# EAGLE design M8-Relay-Dual-Latching (EAGLE 9.6.2)
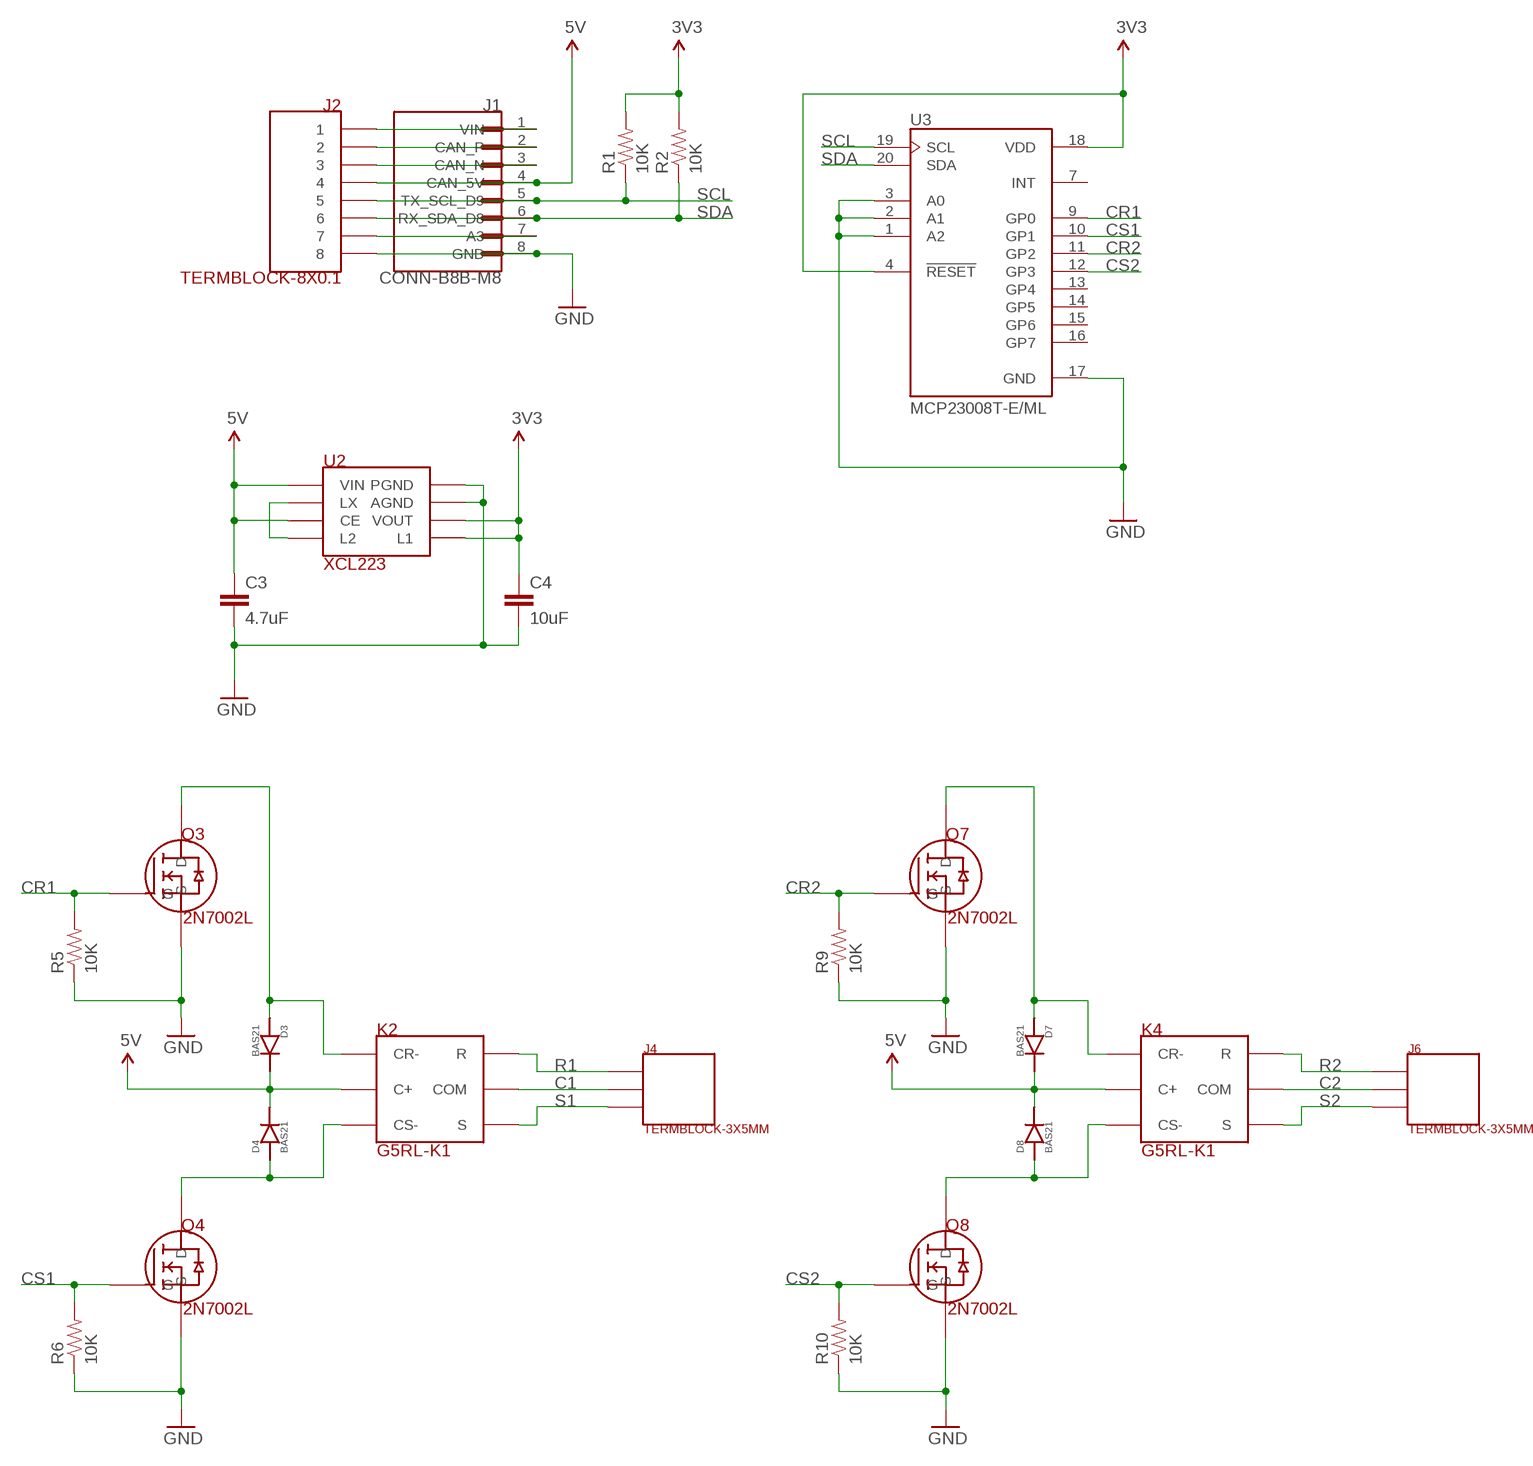
[diagram p0: schematic, sheet 1]

## Parts
C3  4.7uF  CAP-4.7UF-0603  [0603-CAP]
C4  10uF  CAP-10UF-0603  [0603-CAP]
D3  BAS21  DIODE-BAS21  [DIODE-BAS21]
D4  BAS21  DIODE-BAS21  [DIODE-BAS21]
D7  BAS21  DIODE-BAS21  [DIODE-BAS21]
D8  BAS21  DIODE-BAS21  [DIODE-BAS21]
J1  CONN-B8B-M8  [JST_B8B-PH-SM4-TB(LF)(SN)]
J2  TERMBLOCK-8X0.1  [TERMBLOCK-8X0.1]
J4  TERMBLOCK-3X5MM  [TERMBLOCK-3X5MM]
J6  TERMBLOCK-3X5MM  [TERMBLOCK-3X5MM]
K2  G5RL-K1  RELAY-G5RL-K1-E-LATCHING-SPDT  [RELAY-G5RL-K1-E-LATCHING-SPDT]
K4  G5RL-K1  RELAY-G5RL-K1-E-LATCHING-SPDT  [RELAY-G5RL-K1-E-LATCHING-SPDT]
Q3  2N7002L  [2N7002L]
Q4  2N7002L  [2N7002L]
Q7  2N7002L  [2N7002L]
Q8  2N7002L  [2N7002L]
R1  10K  RES-10K-06030603  [0603-RES]
R2  10K  RES-10K-06030603  [0603-RES]
R5  10K  RES-10K-06030603  [0603-RES]
R6  10K  RES-10K-06030603  [0603-RES]
R9  10K  RES-10K-06030603  [0603-RES]
R10  10K  RES-10K-06030603  [0603-RES]
U2  XCL223  REG-XCL223  [REG-XCL223-LESS-CREAM]
U3  MCP23008T-E/ML  [QFN21P50_400X400X100L40X24T270N]

## Nets
3V3: C4.1 R1.2 R2.2 U2.3(VOUT) U2.7(L1) U3.4(!RESET) U3.18(VDD)
5V: C3.1 D3.3(CATHODE) D4.3(CATHODE) D7.3(CATHODE) D8.3(CATHODE) J1.4(CAN_5V) J2.P$4 K2.9(C+) K4.9(C+) U2.4(CE) U2.6(VIN)
A3: J1.7(A3) J2.P$7
C1: J4.2 K2.3(COM) K2.6(COM)
C2: J6.2 K4.3(COM) K4.6(COM)
CAN_N: J1.3(CAN_N) J2.P$3
CAN_P: J1.2(CAN_P) J2.P$2
CR1: Q3.1(G) R5.2 U3.9(GP0)
CR1-1: D3.1(ANODE) K2.1(CR-) Q3.3(D)
CR2: Q7.1(G) R9.2 U3.11(GP2)
CR2-: D7.1(ANODE) K4.1(CR-) Q7.3(D)
CS1: Q4.1(G) R6.2 U3.10(GP1)
CS1-1: D4.1(ANODE) K2.8(CS-) Q4.3(D)
CS2: Q8.1(G) R10.2 U3.12(GP3)
CS2-: D8.1(ANODE) K4.8(CS-) Q8.3(D)
GND: C3.2 C4.2 J1.8(GND) J2.P$8 Q3.2(S) Q4.2(S) Q7.2(S) Q8.2(S) R5.1 R6.1 R9.1 R10.1 U2.1(PGND) U2.2(AGND) U3.1(A2) U3.2(A1) U3.3(A0) U3.17(GND)
LX: U2.5(LX) U2.8(L2)
R1: J4.1 K2.2(R) K2.7(R)
R2: J6.1 K4.2(R) K4.7(R)
S1: J4.3 K2.4(S) K2.5(S)
S2: J6.3 K4.4(S) K4.5(S)
SCL: J1.5(TX_SCL_D9) J2.P$5 R1.1 U3.19(SCL)
SDA: J1.6(RX_SDA_D8) J2.P$6 R2.1 U3.20(SDA)
VIN: J1.1(VIN) J2.P$1
Unconnected: U3.7(INT) U3.13(GP4) U3.14(GP5) U3.15(GP6) U3.16(GP7)

## Library data of the parts
C3 = rickk2:CAP-4.7UF-0603: Murata X5R series CAP CER 4.7UF 6.3V X5R 0603 $0.12 https://www.digikey.com/product-detail/en/murata-electronics-north-america/GRM188R60J475KE19J/490-6407-1-ND/3845604
C4 = rickk2:CAP-10UF-0603: CAP CER 10UF 16V X5R 0805 $ 0.21 https://www.digikey.com/product-detail/en/murata-electronics-north-america/GRM21BR61C106KE15L/490-3886-1-ND/965928
D3 D4 D7 D8 = rickk2:DIODE-BAS21: Diodes Incorporated BAS21-7-F $ 0.14 http://www.digikey.com/product-detail/en/BAS21-7-F/BAS21-FDICT-ND/717813 Surface mount SOT-23-3
J1 = rickk2:CONN-B8B-M8: PH Series 2 mm Pitch 12 Position SMT Single Row Top Entry Shrouded Header
J2 = rickk2:TERMBLOCK-8X0.1: Term Block 8x0.1" 20-30AWG 6A 125V Max Side Entry On Shore Technology Inc. OSTVN08A150 TERM BLK 8P SIDE ENT 2.54MM PCB 8 Position Wire to Board Terminal Block Horizontal with Board 0.100" (2.54mm) Through Hole https://www.digikey.com/product-detail/en/on-shore-technology-inc/OSTVN08A150/ED10566-ND/1588868
J4 J6 = rickk2:TERMBLOCK-3X5MM: TERM BLK 3POS SIDE ENTRY 5MM PCB On Shore Technology Inc. ED700/3 $1.84 3 Position Wire to Board Terminal Block Horizontal with Board 0.197" (5.00mm) Through Hole https://www.digikey.com/product-detail/en/on-shore-technology-inc/ED700-3/ED1632-ND/33961 - 20A 300V - 12-30 AWG - Not ordered yet
K2 K4 = rickk2:RELAY-G5RL-K1-E-LATCHING-SPDT: RELAY GEN PURPOSE SPDT 16A 5V LATCHING Omron Electronics Inc-EMC Div G5RL-K1-E-DC5 $3.70 General Purpose Relay SPDT (1 Form C) 5VDC Coil Through Hole https://www.digikey.com/product-detail/en/omron-electronics-inc-emc-div/G5RL-K1-E-DC5/Z4395-ND/4947136 - 250VAC, 24VDC - Max - 150 mA coil current - Latching, Dual Coil - Operation/Release Time: 15ms - Order 4 - not ordered yet
Q3 Q4 Q7 Q8 = rickk2:2N7002L: MOSFET N-CH 60V 0.115A SOT-23 $ 0.16 On Semicondutor 2N7002LT1G N-Channel 115mA (Tc) 225mW (Ta) Surface Mount SOT-23-3 (TO-236) https://www.digikey.com/product-detail/en/on-semiconductor/2N7002LT3G/2N7002LT3GOSCT-ND/2704932 1=G, high=D is connected to S (GND), the "on" state 2=S to GND (bottom of symbol) 3=D to load (top of symbol, pin on the side by itself) 2A version: Diodes Inc DMN6075S-7 MOSFET N-CH 60V 2A SOT23-3 $0.45 https://www.digikey.com/product-detail/en/diodes-incorporated/DMN6075S-7/DMN6075S-7DICT-ND/5149299 Old: https://www.digikey.com/product-detail/en/on-semiconductor/2N7002LT1G/2N7002LT1GOSCT-ND/917791
R1 R2 R5 R6 R9 R10 = rickk2:RES-10K-0603: RES SMD 10K OHM 5% 1/4W 0603 $ 0.10 https://www.digikey.com/product-detail/en/panasonic-electronic-components/ERJ-PA3J103V/P10KBZCT-ND/5036237
U2 = rickk2:REG-XCL223: Manufacturer: Torex Semiconductor Ltd Manufacturer Part Number: XCL223A333D2-G DC DC CONVERTER 3.3V Detailed Description: Non-Isolated PoL Modul $2.63 https://www.digikey.com/product-detail/en/torex-semiconductor-ltd/XCL223A333D2-G/893-1416-1-ND/8256118 CIN=4.7uF 10V CL = 10uF 10V VIN MAX=5.5V VOUT=3.3V
U3 = rickk2:MCP23008T-E/ML: Not purchased yet Microchip Technology MCP23008T-E/ML $1.10 I/O Expander 8 I²C 1.7MHz 20-QFN-EP (4x4) https://www.digikey.com/product-detail/en/microchip-technology/MCP23008T-E-ML/MCP23008T-E-MLCT-ND/7916525 MCP23008 Series 5.5 V 1.7 MHz 8-Bit I/O Expander with Serial Interface - QFN-20; ARROW_ELECTRONICS-PURCHASE-URL: https://snapeda.com/shop?store=Arrow+Electronics&id=4816241; DESCRIPTION: IC I/O EXPANDER I2C 8B 20QFN; DIGIKEY-PURCHASE-URL: https://snapeda.com/shop?store=DigiKey&id=4816241; MF: Microchip Technology; MOUSER-PURCHASE-URL: https://snapeda.com/shop?store=Mouser&id=4816241; MP: MCP23008T-E/ML; PACKAGE: None

## Board
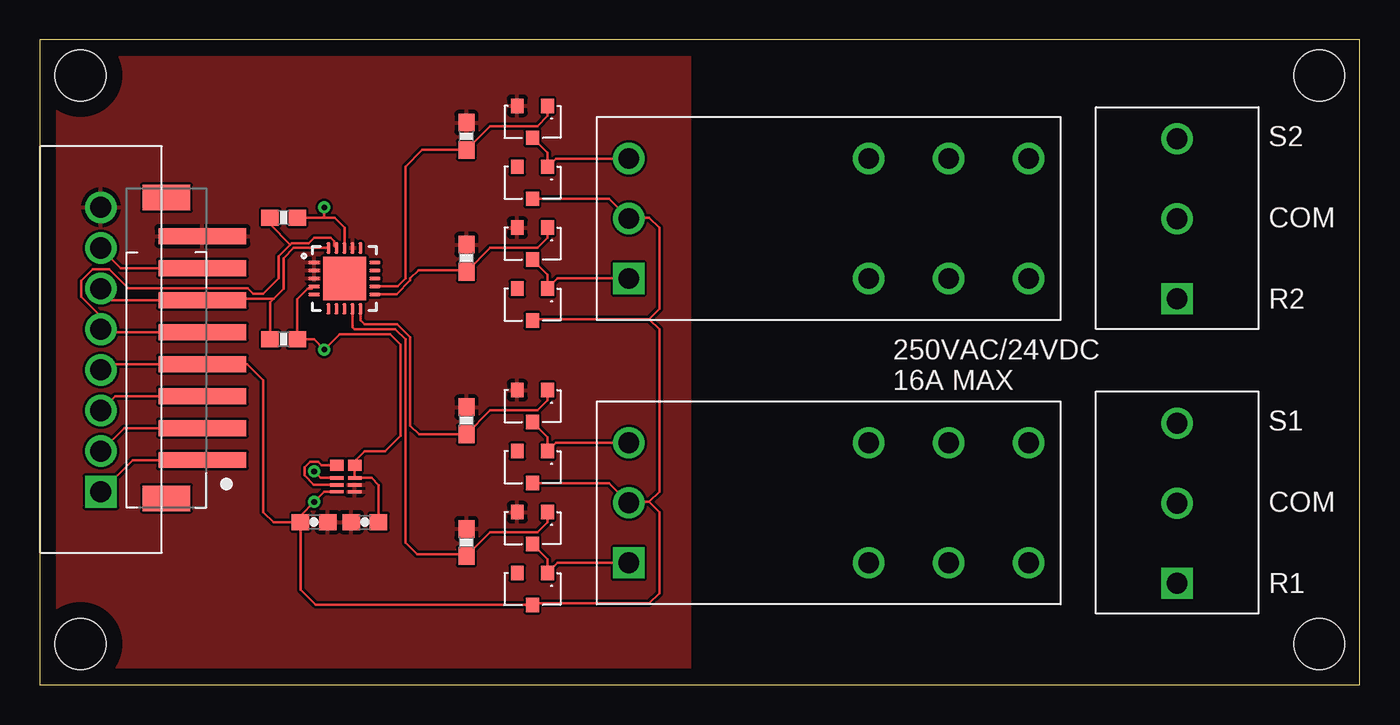
[diagram p1: board, top side]
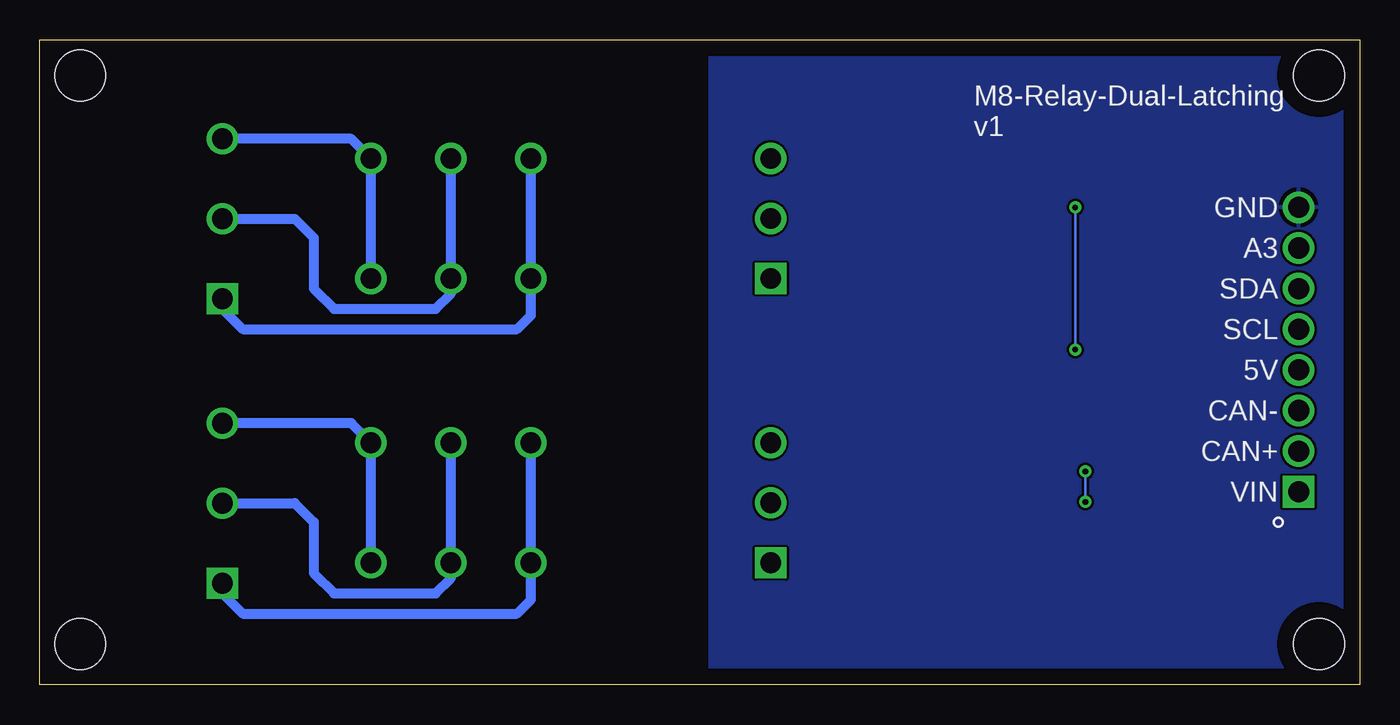
[diagram p2: board, bottom side, seen from below]

Size 82.53 x 40.31 mm. Coordinates in mm from the lower left corner, seen from the top.
Outline: 0,0 82.53,0 82.53,40.31 0,40.31 0,0
Copper layers (1*16): Top 0.035mm / dielectric 1.5mm / Bottom 0.035mm
Design rules "default": minimum track width 6mil, minimum drill 0.35mm, track to track 6mil, track to pad 6mil, pad to pad 6mil, via to via 6mil, smd to smd 6mil, copper to edge 40mil, drill to drill 6mil, minimum pad ring 10mil, minimum via ring 8mil, stop-mask expansion 4mil, vias tented up to drill 0mil, thermal gap 10mil
Holes 3.17 mm at 2.54,2.54 80.01,2.54 80.01,38.1 2.54,38.1

### Footprints (pad centres in the part's own frame; a part is rotated, then mirrored left to right if it is on the bottom)
0603-CAP = smd 1.1 x 1: 1 -0.85,0; 2 0.85,0
DIODE-BAS21 = smd 0.8 x 0.9: 1 0,0; 2 1.9,0; 3 0.95,2
JST_B8B-PH-SM4-TB(LF)(SN) = smd 1 x 5.5: 1 -5,0; 2 -3,0; 3 -1,0; 4 1,0; 5 3,0; 6 5,0; 7 7,0; 8 9,0 | smd 1.6 x 3: P1 -7.4,2.25; P2 11.4,2.25
TERMBLOCK-8X0.1 = drill 1.321 square: P$1 -8.89,0 | drill 1.321: P$2 -6.35,0; P$3 -3.81,0; P$4 -1.27,0; P$5 1.27,0; P$6 3.81,0; P$7 6.35,0; P$8 8.89,0
TERMBLOCK-3X5MM = drill 1.3 square: 1 0,0 | drill 1.3: 2 5,0; 3 10,0
RELAY-G5RL-K1-E-LATCHING-SPDT = drill 1.3 square: 1 0,0 | drill 1.3: 2 15,0; 3 20,0; 4 25,0; 5 25,7.5; 6 20,7.5; 7 15,7.5; 8 0,7.5; 9 0,3.75
2N7002L = smd 0.8 x 0.9: 1 0,0; 2 1.9,0; 3 0.95,2
0603-RES = smd 1.1 x 1: 1 -0.85,0; 2 0.85,0
REG-XCL223-LESS-CREAM = smd 0.85 x 0.21: 1 0,0; 2 0,0.43; 3 0,0.86; 4 -1.11,0.86; 5 -1.11,0.43; 6 -1.11,0 | smd 0.85 x 0.7: 7 0,1.655; 8 -1.11,1.655
QFN21P50_400X400X100L40X24T270N = smd 0.71 x 0.26: 1 -1.905,1; 2 -1.905,0.5; 3 -1.905,0; 4 -1.905,-0.5; 5 -1.905,-1; 11 1.905,-1; 12 1.905,-0.5; 13 1.905,0; 14 1.905,0.5; 15 1.905,1 | smd 0.26 x 0.71: 6 -1,-1.905; 7 -0.5,-1.905; 8 0,-1.905; 9 0.5,-1.905; 10 1,-1.905; 16 1,1.905; 17 0.5,1.905; 18 0,1.905; 19 -0.5,1.905; 20 -1,1.905 | smd 2.7 x 2.7: 21 0,0

### Placement (x,y rotation side)
C3  17.14,10.16 0 top
C4  20.32,10.16 180 top
D3  31.75,6.99 180 top
D4  31.75,14.61 180 top
D7  31.75,24.77 180 top
D8  31.75,32.38 180 top
J1  10.16,19.05 90 top
J2  3.81,20.95 90 top
J4  71.12,6.35 90 top
J6  71.12,24.13 90 top
K2  36.83,7.62 0 top
K4  36.83,25.4 0 top
Q3  31.75,10.79 180 top
Q4  31.75,18.41 180 top
Q7  31.75,28.57 180 top
Q8  31.75,36.2 180 top
R1  15.24,29.21 0 top
R2  15.24,21.59 0 top
R5  26.67,8.89 270 top
R6  26.67,16.51 270 top
R9  26.67,26.67 270 top
R10  26.67,34.29 270 top
U2  19.68,12.06 0 top
U3  19.05,25.4 0 top

### Tracks (layer width: path | path; a pad name or v marks a point on that pad's centre or on a via)
3V3  (via drill 0.35)
  Top 0.152: C4.1 21.17,12.48 20.73,12.93 U2.3 U2.7 19.68,13.97 20.32,14.61 21.59,14.61 22.55,15.57 22.55,21.26 21.89,21.92 18.75,21.92 v17.78,20.95 17.14,21.59 R2.2 16.09,24.11 16.74,24.76 17,24.76 U3.4 | R1.2 17.78,29.21 | 17.78,29.21 18.41,29.21 19.05,28.57 U3.18 | v17.78,29.84 17.78,29.21
  Bottom 0.152: v17.78,29.84 v17.78,20.95
5V  (via drill 0.35)
  Top 0.152: U2.4 17.55,12.93 v17.14,13.34 | C3.1 16.09,10.37 15.88,10.16 14.61,10.16 13.97,10.79 13.97,19.05 12.97,20.05 J1.4 4.17,20.05 J2.P$4 | U2.6 17.78,12.06 v17.14,11.43 16.3,10.58 C3.1 | 38.1,11.43 38.73,10.79 38.73,5.71 38.1,5.08 30.89,5.08 D3.3 17.24,4.99 16.3,5.93 C3.1 | 38.1,11.43 36.89,11.43 K2.9 35.59,12.61 D4.3 | D7.3 30.89,22.86 38.1,22.86 | 38.1,22.86 38.73,23.5 38.73,28.57 38.1,29.21 36.89,29.21 K4.9 35.59,30.39 D8.3 | 38.1,11.43 38.73,12.06 38.73,22.23 38.1,22.86
  Bottom 0.152: v17.14,13.34 v17.14,11.43
A3
  Top 0.152: J1.7 5.07,26.05 J2.P$7
C1
  Bottom 0.61: J4.2 66.59,11.35 65.41,10.16 65.41,6.99 64.14,5.71 57.78,5.71 56.83,6.67 K2.3 K2.6
C2
  Bottom 0.61: J6.2 66.59,29.13 65.41,27.94 65.41,24.77 64.14,23.5 57.78,23.5 56.83,24.45 K4.3 K4.6
CAN_N
  Top 0.152: J1.3 4.71,18.05 J2.P$3
CAN_P
  Top 0.152: J1.2 5.25,16.05 J2.P$2
CR1
  Top 0.152: R5.2 26.78,8.15 | 26.78,8.15 28.16,9.53 31.11,9.53 31.75,10.16 Q3.1 | U3.9 19.55,22.36 19.68,22.23 22.23,22.23 22.86,21.59 22.86,8.89 23.6,8.15 26.78,8.15
CR1-1
  Top 0.152: K2.1 32.38,7.62 D3.1 31.75,7.84 Q3.3
CR2
  Top 0.152: R9.2 26.78,25.93 | 26.78,25.93 28.16,27.3 31.11,27.3 31.75,27.94 Q7.1 | U3.11 22.29,24.4 23.16,25.27 23.16,25.4 23.69,25.93 26.78,25.93
CR2-
  Top 0.152: K4.1 32.38,25.4 D7.1 31.75,25.62 Q7.3
CS1
  Top 0.152: Q4.1 31.75,17.78 31.11,17.14 28.16,17.14 R6.2 23.71,15.66 23.16,16.2 23.16,21.72 22.35,22.53 20.32,22.53 20.05,22.8 U3.10
CS1-1
  Top 0.152: K2.8 32.27,15.12 D4.1 31.75,15.46 Q4.3
CS2
  Top 0.152: Q8.1 31.75,35.56 31.11,34.92 28.16,34.92 R10.2 23.91,33.44 22.86,32.38 22.86,25.4 22.36,24.9 U3.12
CS2-
  Top 0.152: K4.8 32.27,32.9 D8.1 31.75,33.24 Q8.3
GND
  pour Top: 0,0 0,46.99 1.27,46.99 40.64,46.99 40.64,0
  pour Bottom: 0,0 0,48.26 40.64,48.26 40.64,0
LX
  Top 0.152: U2.8 17.62,13.72 17.4,13.94 16.89,13.94 16.54,13.59 16.54,13.08 17.13,12.49 U2.5
R1
  Bottom 0.61: J4.1 71.12,5.71 69.85,4.45 52.7,4.45 51.83,5.32 K2.2 K2.7
R2
  Bottom 0.61: J6.1 71.12,23.5 69.85,22.23 52.7,22.23 51.83,23.1 K4.2 K4.7
S1
  Bottom 0.61: K2.4 K2.5 63.06,16.35 J4.3
S2
  Bottom 0.61: K4.4 K4.5 63.06,34.13 J6.3
SCL
  Top 0.152: J1.5 3.98,22.05 J2.P$5 3.81,23.04 2.59,24.26 2.59,25.27 3.31,25.98 4.32,25.98 5.52,24.78 13.01,24.78 13.35,24.43 13.97,24.43 14.94,25.4 14.94,26.8 15.66,27.52 | 15.66,27.52 15.75,27.61 16.82,27.61 17.14,27.94 18.18,27.94 18.41,27.71 18.41,27.45 U3.19 | R1.1 14.39,28.79 15.66,27.52
SDA
  Top 0.152: J2.P$6 4.53,24.05 J1.6 10.24,24.13 14.61,24.13 | 14.61,24.13 15.24,24.77 15.24,26.67 15.88,27.3 U3.20 | R2.1 14.39,23.91 14.61,24.13
VIN
  Top 0.152: J2.P$1 5.79,14.05 J1.1

### Text on the board
tPlace: S2 | COM | R2 | 250VAC/24VDC / 16A MAX | S1 | COM | R1
bPlace: M8-Relay-Dual-Latching / v1 | GND | A3 | SDA | SCL | 5V | CAN- | CAN+ | VIN